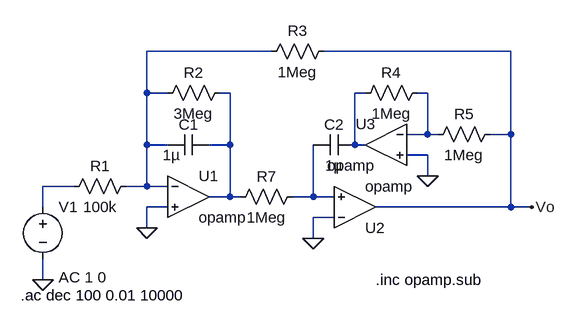
[diagram p0: schematic TS2.asc]
TS2.asc, the LTspice schematic file:
Version 4
SHEET 1 880 680
WIRE 320 -144 128 -144
WIRE 688 -144 400 -144
WIRE 128 -80 128 -144
WIRE 160 -80 128 -80
WIRE 256 -80 240 -80
WIRE 464 -80 448 -80
WIRE 560 -80 544 -80
WIRE 560 -16 560 -80
WIRE 560 -16 528 -16
WIRE 576 -16 560 -16
WIRE 688 -16 688 -144
WIRE 688 -16 656 -16
WIRE 128 0 128 -80
WIRE 160 0 128 0
WIRE 256 0 256 -80
WIRE 256 0 224 0
WIRE 448 0 448 -80
WIRE 464 0 448 0
WIRE 560 16 528 16
WIRE 560 48 560 16
WIRE 16 64 -32 64
WIRE 128 64 128 0
WIRE 128 64 96 64
WIRE 160 64 128 64
WIRE 256 80 256 0
WIRE 256 80 224 80
WIRE 272 80 256 80
WIRE 384 80 384 0
WIRE 384 80 352 80
WIRE 416 80 384 80
WIRE -32 96 -32 64
WIRE 160 96 128 96
WIRE 688 96 688 -16
WIRE 688 96 480 96
WIRE 720 96 688 96
WIRE 416 112 384 112
WIRE 128 128 128 96
WIRE 384 144 384 112
WIRE -32 208 -32 176
FLAG 384 144 0
FLAG 128 128 0
FLAG 560 48 0
FLAG -32 208 0
FLAG 720 96 Vo
SYMBOL Opamps\\opamp 192 16 R0
SYMATTR InstName U1
SYMBOL Opamps\\opamp 448 160 M180
SYMATTR InstName U2
SYMBOL Opamps\\opamp 496 -64 M0
SYMATTR InstName U3
SYMBOL res 112 48 R90
WINDOW 0 0 56 VBottom 2
WINDOW 3 32 56 VTop 2
SYMATTR InstName R1
SYMATTR Value 100k
SYMBOL cap 224 -16 R90
WINDOW 0 0 32 VBottom 2
WINDOW 3 16 58 VTop 2
SYMATTR InstName C1
SYMATTR Value 1µ
SYMBOL res 256 -96 R90
WINDOW 0 0 56 VBottom 2
WINDOW 3 32 56 VTop 2
SYMATTR InstName R2
SYMATTR Value 3Meg
SYMBOL res 416 -160 R90
WINDOW 0 0 56 VBottom 2
WINDOW 3 32 56 VTop 2
SYMATTR InstName R3
SYMATTR Value 1Meg
SYMBOL res 560 -96 R90
WINDOW 0 0 56 VBottom 2
WINDOW 3 32 56 VTop 2
SYMATTR InstName R4
SYMATTR Value 1Meg
SYMBOL res 368 64 R90
WINDOW 0 0 56 VBottom 2
WINDOW 3 32 56 VTop 2
SYMATTR InstName R7
SYMATTR Value 1Meg
SYMBOL cap 448 -16 R90
WINDOW 0 0 32 VBottom 2
WINDOW 3 32 32 VTop 2
SYMATTR InstName C2
SYMATTR Value 1µ
SYMBOL res 672 -32 R90
WINDOW 0 0 56 VBottom 2
WINDOW 3 32 56 VTop 2
SYMATTR InstName R5
SYMATTR Value 1Meg
SYMBOL voltage -32 80 R0
WINDOW 123 24 124 Left 2
WINDOW 39 0 0 Left 0
SYMATTR InstName V1
SYMATTR Value ""
SYMATTR Value2 AC 1 0
TEXT -66 232 Left 2 !.ac dec 100 0.01 10000
TEXT 480 208 Left 2 !.inc opamp.sub

The netlist it stands for:
* TS2.asc
XU1 N001 0 N002 opamp Aol=100K GBW=10Meg  ; pins invin noninvin out
XU2 0 N006 Vo opamp Aol=100K GBW=10Meg  ; pins invin noninvin out
XU3 N004 0 N003 opamp Aol=100K GBW=10Meg  ; pins invin noninvin out
R1 N001 N005 100k
C1 N002 N001 1µ
R2 N002 N001 3Meg
R3 Vo N001 1Meg
R4 N004 N003 1Meg
R7 N006 N002 1Meg
C2 N003 N006 1µ
R5 Vo N004 1Meg
V1 N005 0 AC 1 0
.ac dec 100 0.01 10000
.inc opamp.sub
.backanno
.end